# EasyEDA schematic salidas programables easy eda.json
TITLE: Control de salidas; REV: 2; Date: 2022-01-11; Sheet: 1/1; Drawn By: robert382; Company: Spectra
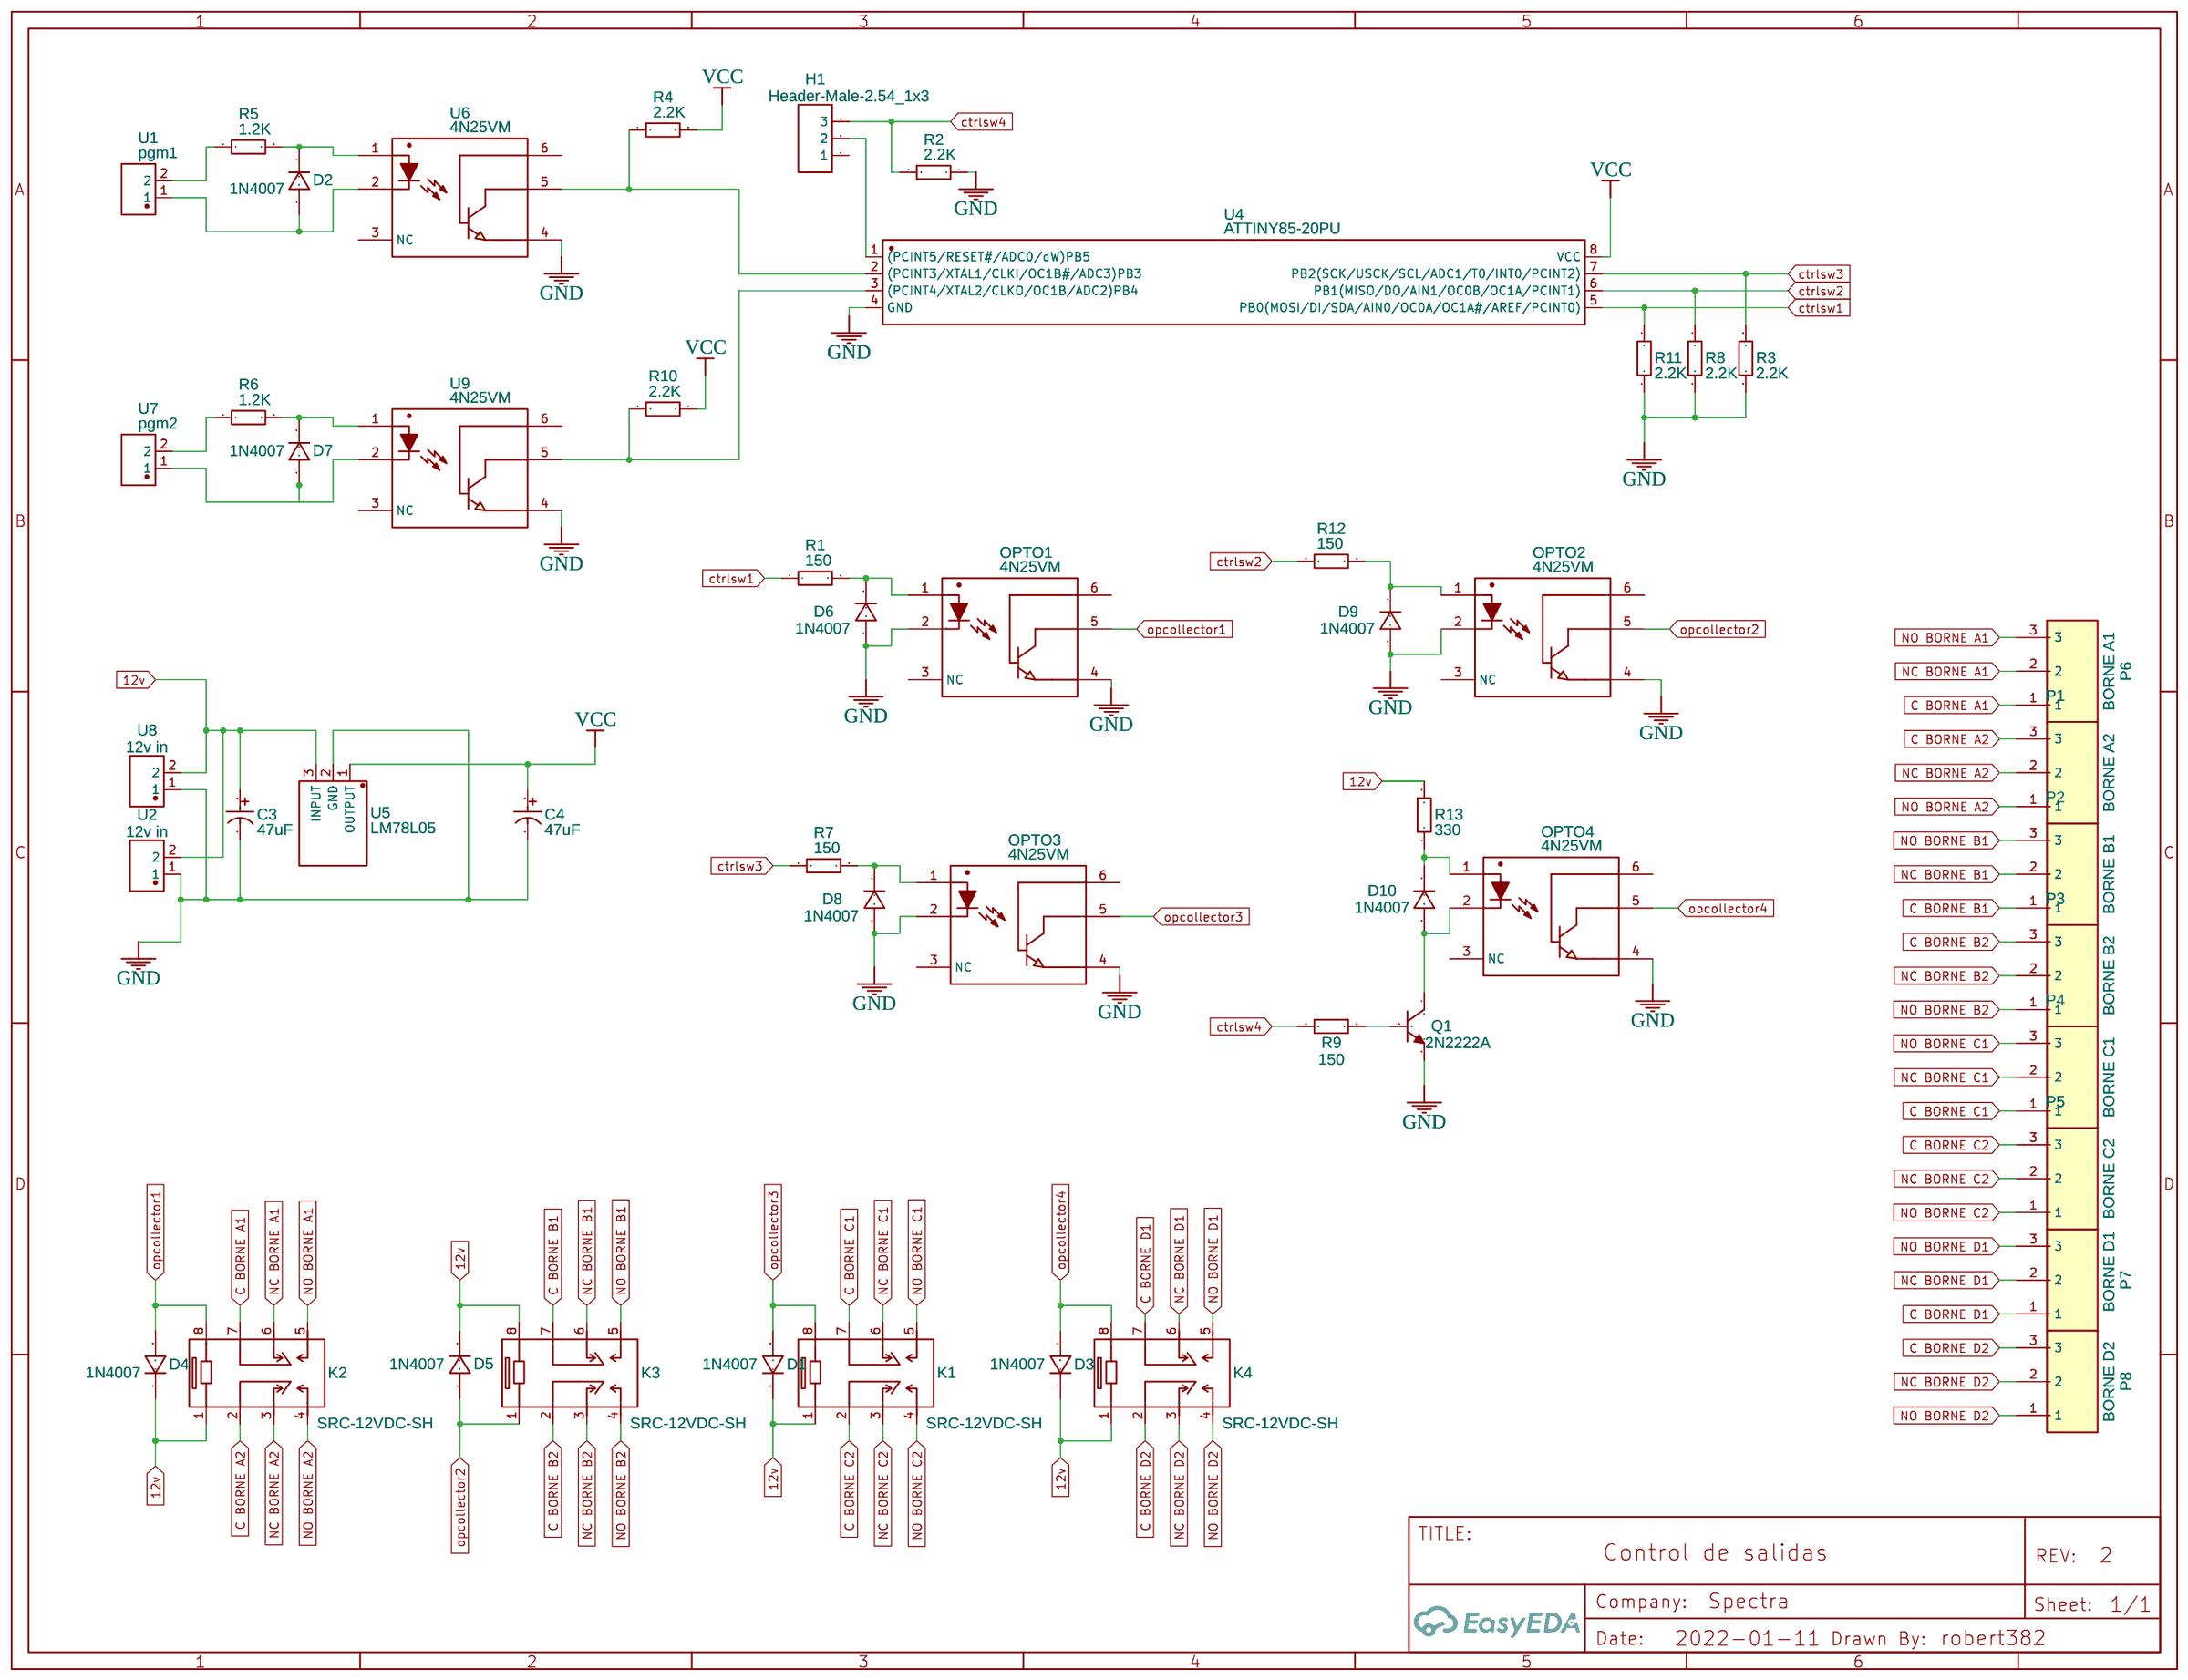
[diagram p0: schematic sheet]

## Parts
C3  47uF  [CAP-TH_BD8.0-P3.50-D0.6-FD]
C4  47uF  [CAP-TH_BD8.0-P3.50-D0.6-FD]
D1  1N4007  [DO-41_BD2.4-L4.7-P8.70-D0.9-RD]
D2  1N4007  [DO-41_BD2.4-L4.7-P8.70-D0.9-RD]
D3  1N4007  [DO-41_BD2.4-L4.7-P8.70-D0.9-RD]
D4  1N4007  [DO-41_BD2.4-L4.7-P8.70-D0.9-RD]
D5  1N4007  [DO-41_BD2.4-L4.7-P8.70-D0.9-RD]
D6  1N4007  [DO-41_BD2.4-L4.7-P8.70-D0.9-RD]
D7  1N4007  [DO-41_BD2.4-L4.7-P8.70-D0.9-RD]
D8  1N4007  [DO-41_BD2.4-L4.7-P8.70-D0.9-RD]
D9  1N4007  [DO-41_BD2.4-L4.7-P8.70-D0.9-RD]
D10  1N4007  [DO-41_BD2.4-L4.7-P8.70-D0.9-RD]
H1  Header-Male-2.54_1x3  [HDR-TH_3P-P2.54-V-M-1]
K1  SRC-12VDC-SH  [RELAY-TH_SRC-12VDC-SH]
K2  SRC-12VDC-SH  [RELAY-TH_SRC-12VDC-SH]
K3  SRC-12VDC-SH  [RELAY-TH_SRC-12VDC-SH]
K4  SRC-12VDC-SH  [RELAY-TH_SRC-12VDC-SH]
OPTO1  4N25VM  [PDIP-6_L8.5-W6.5-P2.54-LS7.6-BL]
OPTO2  4N25VM  [PDIP-6_L8.5-W6.5-P2.54-LS7.6-BL]
OPTO3  4N25VM  [PDIP-6_L8.5-W6.5-P2.54-LS7.6-BL]
OPTO4  4N25VM  [PDIP-6_L8.5-W6.5-P2.54-LS7.6-BL]
P1  BORNE A2  [CONN-TH_3P-P5.00_WJ126V-5.0-3P]
P2  BORNE B1  [CONN-TH_3P-P5.00_WJ126V-5.0-3P]
P3  BORNE B2  [CONN-TH_3P-P5.00_WJ126V-5.0-3P]
P4  BORNE C1  [CONN-TH_3P-P5.00_WJ126V-5.0-3P]
P5  BORNE C2  [CONN-TH_3P-P5.00_WJ126V-5.0-3P]
P6  BORNE A1  [CONN-TH_3P-P5.00_WJ126V-5.0-3P]
P7  BORNE D1  [CONN-TH_3P-P5.00_WJ126V-5.0-3P]
P8  BORNE D2  [CONN-TH_3P-P5.00_WJ126V-5.0-3P]
Q1  2N2222A  [TO-92-3_L4.8-W3.7-P2.54-R]
R1  150  [RES-TH_BD1.8-L3.2-P7.20-D0.4]
R2  2.2K  [RES-TH_BD2.3-L6.5-P10.50-D0.5]
R3  2.2K  [RES-TH_BD2.3-L6.5-P10.50-D0.5]
R4  2.2K  [RES-TH_BD2.3-L6.5-P10.50-D0.5]
R5  1.2K  [RES-TH_BD2.2-L6.5-P10.50-D0.9]
R6  1.2K  [RES-TH_BD2.2-L6.5-P10.50-D0.9]
R7  150  [RES-TH_BD1.8-L3.2-P7.20-D0.4]
R8  2.2K  [RES-TH_BD2.3-L6.5-P10.50-D0.5]
R9  150  [RES-TH_BD1.8-L3.2-P7.20-D0.4]
R10  2.2K  [RES-TH_BD2.3-L6.5-P10.50-D0.5]
R11  2.2K  [RES-TH_BD2.3-L6.5-P10.50-D0.5]
R12  150  [RES-TH_BD1.8-L3.2-P7.20-D0.4]
R13  330  [RES-TH_BD2.3-L6.5-P6.9-D0.5]
U1  pgm1  [CONN-TH_KY0200500000G]
U2  12v in  [CONN-TH_KY0200500000G]
U4  ATTINY85-20PU  [PDIP-8_L9.3-W6.4-P2.54-LS7.6-BL]
U5  LM78L05  [TO-92-3_L4.9-W3.7-P1.27-L]
U6  4N25VM  [PDIP-6_L8.5-W6.5-P2.54-LS7.6-BL]
U7  pgm2  [CONN-TH_KY0200500000G]
U8  12v in  [CONN-TH_KY0200500000G]
U9  4N25VM  [PDIP-6_L8.5-W6.5-P2.54-LS7.6-BL]

## Library data of the parts
C3 C4 = SH476M035F0800: Supplier: LCSC; Manufacturer: HONOR; Supplier Part: C99831
D1-D10 = 1N4007-C169152: Supplier Part: C169152; Supplier: LCSC; Manufacturer: DIOFIT; Contributor: LCSC; JLCPCB Part Class: Extended Part
H1 = Header-Male-2.54_1x3: Supplier: LCSC; Manufacturer: BOOMELE; Manufacturer Part: Header2.54mm 1*3P; Supplier Part: C49257; JLCPCB Part Class: Extended Part
K1-K4 = SRC-12VDC-SH: Supplier: LCSC; Supplier Part: C192464; Manufacturer: Ningbo Songle Relay; Contributor: LCSC; JLCPCB Part Class: Extended Part
OPTO1-OPTO4 U6 U9 = 4N25VM: Supplier: LCSC; Supplier Part: C898943; Manufacturer: ON(安森美); Contributor: LCSC
P1-P8 = WJ126V-5.0-3P: Supplier: LCSC; Manufacturer: ReliaPro; Supplier Part: C8401; JLCPCB Part Class: Extended Part
Q1 = 2N2222A: Supplier: LCSC; Supplier Part: C358533; Manufacturer: Foshan Blue Rocket Elec; Contributor: LCSC; JLCPCB Part Class: Extended Part
R1 R7 R9 R12 = MF1/8W-150Ω±1% T52: Supplier: LCSC; Supplier Part: C119160; Manufacturer: Chian Chia Elec; Contributor: LCSC
R2-R4 R8 R10 R11 = MF1/4W-2.2KΩ±1% T52: Supplier: LCSC; Supplier Part: C119331; Manufacturer: Chian Chia Elec; Contributor: LCSC
R5 R6 = CF1/6W-1.2KΩ±5% T52: Supplier: LCSC; Supplier Part: C119872; Manufacturer: Chian Chia Elec; Contributor: LCSC
R13 = 330Ω (331) ±5%: Supplier: LCSC; Supplier Part: C10322; Manufacturer: Made in China; Contributor: LCSC
U1 U2 U7 U8 = KY0200500000G: Supplier: LCSC; Supplier Part: C967069; Manufacturer: Amphenol; Contributor: LCSC
U4 = ATTINY85-20PU: Supplier: LCSC; Supplier Part: C965497; Manufacturer: MICROCHIP(美国微芯); Contributor: LCSC
U5 = LM78L05ACZXA: Supplier: LCSC; Supplier Part: C236945; Manufacturer: ON Semicon; Contributor: LCSC

## Nets
12v: C3.1 D1.1 D3.1 D4.1 D5.1 K1.1 K2.1 K3.8 K4.1 R13.2 U2.2 U5.3(INPUT) U8.2
GND: C3.2 C4.2 D6.2 D8.2 D9.2 OPTO1.2(C) OPTO1.4(E) OPTO2.2(C) OPTO2.4(E) OPTO3.2(C) OPTO3.4(E) OPTO4.4(E) Q1.3(E) R2.1 R3.1 R8.1 R11.1 U2.1 U4.4(GND) U5.2(GND) U6.4(E) U8.1 U9.4(E)
VCC: C4.1 R4.2 R10.1 U4.8(VCC) U5.1(OUTPUT)
C BORNE A1: K2.7 P6.1
C BORNE A2: K2.2 P1.3
C BORNE B1: K3.7 P2.1
C BORNE B2: K3.2 P3.3
C BORNE C1: K1.7 P4.1
C BORNE C2: K1.2 P5.3
C BORNE D1: K4.7 P7.1
C BORNE D2: K4.2 P8.3
ctrlsw1: R1.1 R11.2 U4.5(PB0(MOSI/DI/SDA/AIN0/OC0A/OC1A#/AREF/PCINT0))
ctrlsw2: R8.2 R12.1 U4.6(PB1(MISO/DO/AIN1/OC0B/OC1A/PCINT1))
ctrlsw3: R3.2 R7.1 U4.7(PB2(SCK/USCK/SCL/ADC1/T0/INT0/PCINT2))
ctrlsw4: H1.3 R2.2 R9.1
NC BORNE A1: K2.6 P6.2
NC BORNE A2: K2.3 P1.2
NC BORNE B1: K3.6 P2.2
NC BORNE B2: K3.3 P3.2
NC BORNE C1: K1.6 P4.2
NC BORNE C2: K1.3 P5.2
NC BORNE D1: K4.6 P7.2
NC BORNE D2: K4.3 P8.2
NO BORNE A1: K2.5 P6.3
NO BORNE A2: K2.4 P1.1
NO BORNE B1: K3.5 P2.3
NO BORNE B2: K3.4 P3.1
NO BORNE C1: K1.5 P4.3
NO BORNE C2: K1.4 P5.1
NO BORNE D1: K4.5 P7.3
NO BORNE D2: K4.4 P8.1
opcollector1: D4.2 K2.8 OPTO1.5(C)
opcollector2: D5.2 K3.1 OPTO2.5(C)
opcollector3: D1.2 K1.8 OPTO3.5(C)
opcollector4: D3.2 K4.8 OPTO4.5(C)
Net-(D2-1): D2.1 R5.2 U6.1(A)
Net-(D2-2): D2.2 U1.1 U6.2(C)
Net-(D6-1): D6.1 OPTO1.1(A) R1.2
Net-(D7-1): D7.1 R6.2 U9.1(A)
Net-(D7-2): D7.2 U7.1 U9.2(C)
Net-(D8-1): D8.1 OPTO3.1(A) R7.2
Net-(D9-1): D9.1 OPTO2.1(A) R12.2
Net-(D10-1): D10.1 OPTO4.1(A) R13.1
Net-(D10-2): D10.2 OPTO4.2(C) Q1.1(C)
Net-(H1-2): H1.2 U4.1((PCINT5/RESET#/ADC0/dW)PB5)
Net-(Q1-2): Q1.2(B) R9.2
Net-(R4-1): R4.1 U4.2((PCINT3/XTAL1/CLKI/OC1B#/ADC3)PB3) U6.5(C)
Net-(R5-1): R5.1 U1.2
Net-(R6-1): R6.1 U7.2
Net-(R10-2): R10.2 U4.3((PCINT4/XTAL2/CLKO/OC1B/ADC2)PB4) U9.5(C)

Not connected (* = marked no-connect by the designer): H1 1; OPTO1 3(NC) 6(B); OPTO2 3(NC) 6(B); OPTO3 3(NC) 6(B); OPTO4 3(NC) 6(B); U6 3(NC) 6(B); U9 3(NC) 6(B)
